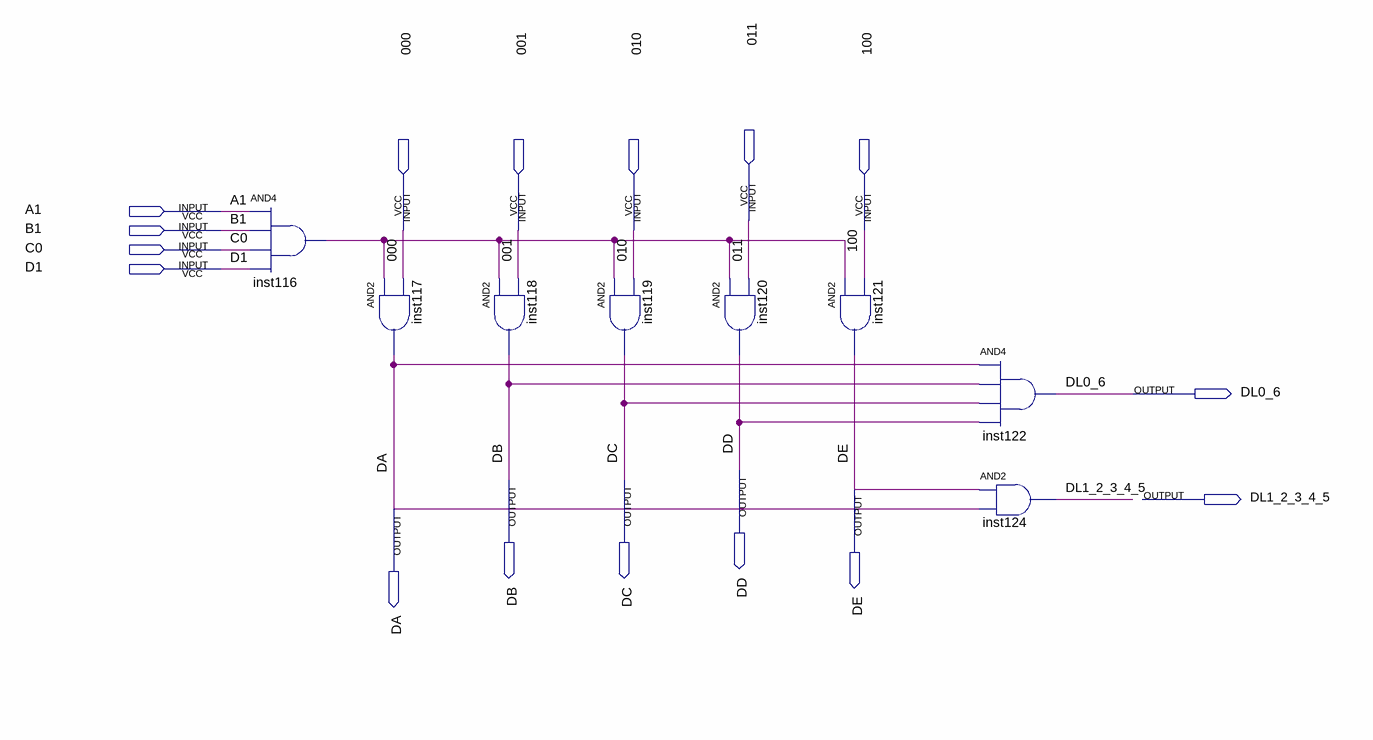
[diagram p0: schematic sheet]
// Quartus schematic caracD.bdf as structural Verilog: 8 symbols, 16 pins
module caracD (
  input  A1,
  input  \011 ,
  input  B1,
  input  \000 ,
  input  \001 ,
  input  \010 ,
  input  \100 ,
  input  C0,
  input  D1,
  output DL0_6,
  output DD,
  output DB,
  output DC,
  output DE,
  output DL1_2_3_4_5,
  output DA
);

  wire inst116_out;

  and inst116 (inst116_out, A1, B1, C0, D1);
  and inst117 (DA, inst116_out, \000 );
  and inst118 (DB, inst116_out, \001 );
  and inst119 (DC, inst116_out, \010 );
  and inst120 (DD, inst116_out, \011 );
  and inst121 (DE, inst116_out, \100 );
  and inst122 (DL0_6, DA, DB, DC, DD);
  and inst124 (DL1_2_3_4_5, DE, DA);
endmodule
